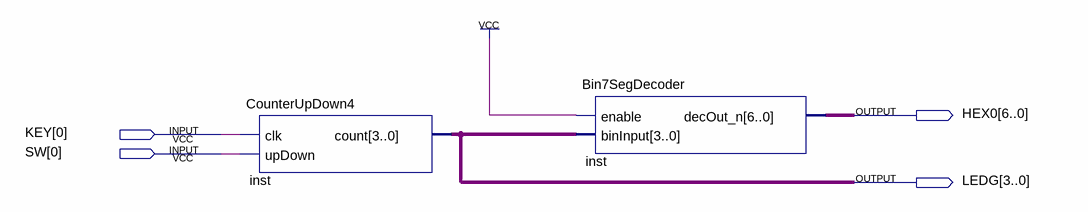
[diagram p0: schematic sheet]
// Quartus schematic Counter_Demo.bdf as structural Verilog: 2 symbols, 4 pins
module Counter_Demo (
  input  [0:0] KEY,
  input  [0:0] SW,
  output [6:0] HEX0,
  output [3:0] LEDG
);

  CounterUpDown4 inst (.clk(KEY[0]), .upDown(SW[0]), .count(LEDG));
  Bin7SegDecoder inst_dup2 (.enable(1'b1), .binInput(LEDG), .decOut_n(HEX0));
endmodule
